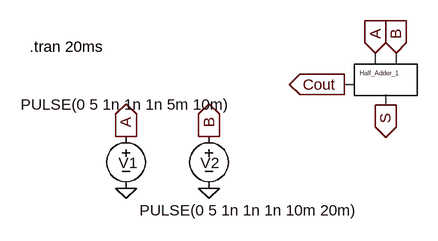
[diagram p0: schematic Simulation_Half_Adder.asc]
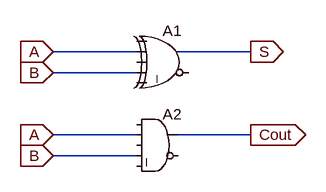
[diagram p1: sub-circuit half_adder.asc]
Simulation_Half_Adder.asc, the LTspice schematic file:
Version 4
SHEET 1 880 680
WIRE 336 64 336 48
WIRE 368 64 368 48
WIRE 304 96 288 96
WIRE 352 128 352 112
FLAG 336 48 A
IOPIN 336 48 In
FLAG 368 48 B
IOPIN 368 48 In
FLAG -48 256 0
FLAG 80 256 0
FLAG -48 176 A
IOPIN -48 176 Out
FLAG 80 176 B
IOPIN 80 176 Out
FLAG 288 96 Cout
IOPIN 288 96 Out
FLAG 352 128 S
IOPIN 352 128 Out
SYMBOL Half_Adder 352 96 R0
SYMATTR InstName Half_Adder_1
SYMBOL voltage -48 160 R0
WINDOW 0 -11 57 Left 2
WINDOW 3 -162 -33 Left 2
WINDOW 123 0 0 Left 0
WINDOW 39 0 0 Left 0
SYMATTR InstName V1
SYMATTR Value PULSE(0 5 1n 1n 1n 5m 10m)
SYMBOL voltage 80 160 R0
WINDOW 0 -13 57 Left 2
WINDOW 3 -107 130 Left 2
WINDOW 123 0 0 Left 0
WINDOW 39 0 0 Left 0
SYMATTR InstName V2
SYMATTR Value PULSE(0 5 1n 1n 1n 10m 20m)
TEXT -196 38 Left 2 !.tran 20ms

half_adder.asc, the sub-circuit schematic file:
Version 4
SHEET 1 880 680
WIRE 128 80 0 80
WIRE 304 80 192 80
WIRE 128 112 0 112
WIRE 128 208 0 208
WIRE 304 208 192 208
WIRE 128 240 0 240
FLAG 0 80 A
IOPIN 0 80 In
FLAG 0 208 A
IOPIN 0 208 In
FLAG 0 112 B
IOPIN 0 112 In
FLAG 0 240 B
IOPIN 0 240 In
FLAG 304 80 S
IOPIN 304 80 Out
FLAG 304 208 Cout
IOPIN 304 208 Out
SYMBOL Digital\\xor 176 32 R0
SYMATTR InstName A1
SYMBOL Digital\\and 160 160 R0
SYMATTR InstName A2

The netlist it stands for:
* Simulation_Half_Adder.asc
XHalf_Adder_1 A B Cout S half_adder
V1 A 0 PULSE(0 5 1n 1n 1n 5m 10m)
V2 B 0 PULSE(0 5 1n 1n 1n 10m 20m)

* block symbol definitions
.subckt half_adder A B Cout S
A1 0 A 0 B 0 0 S 0 XOR
A2 0 A 0 B 0 0 Cout 0 AND
.ends half_adder

.tran 20ms
.backanno
.end